# Altium project Keyboard_Project.PrjPcb
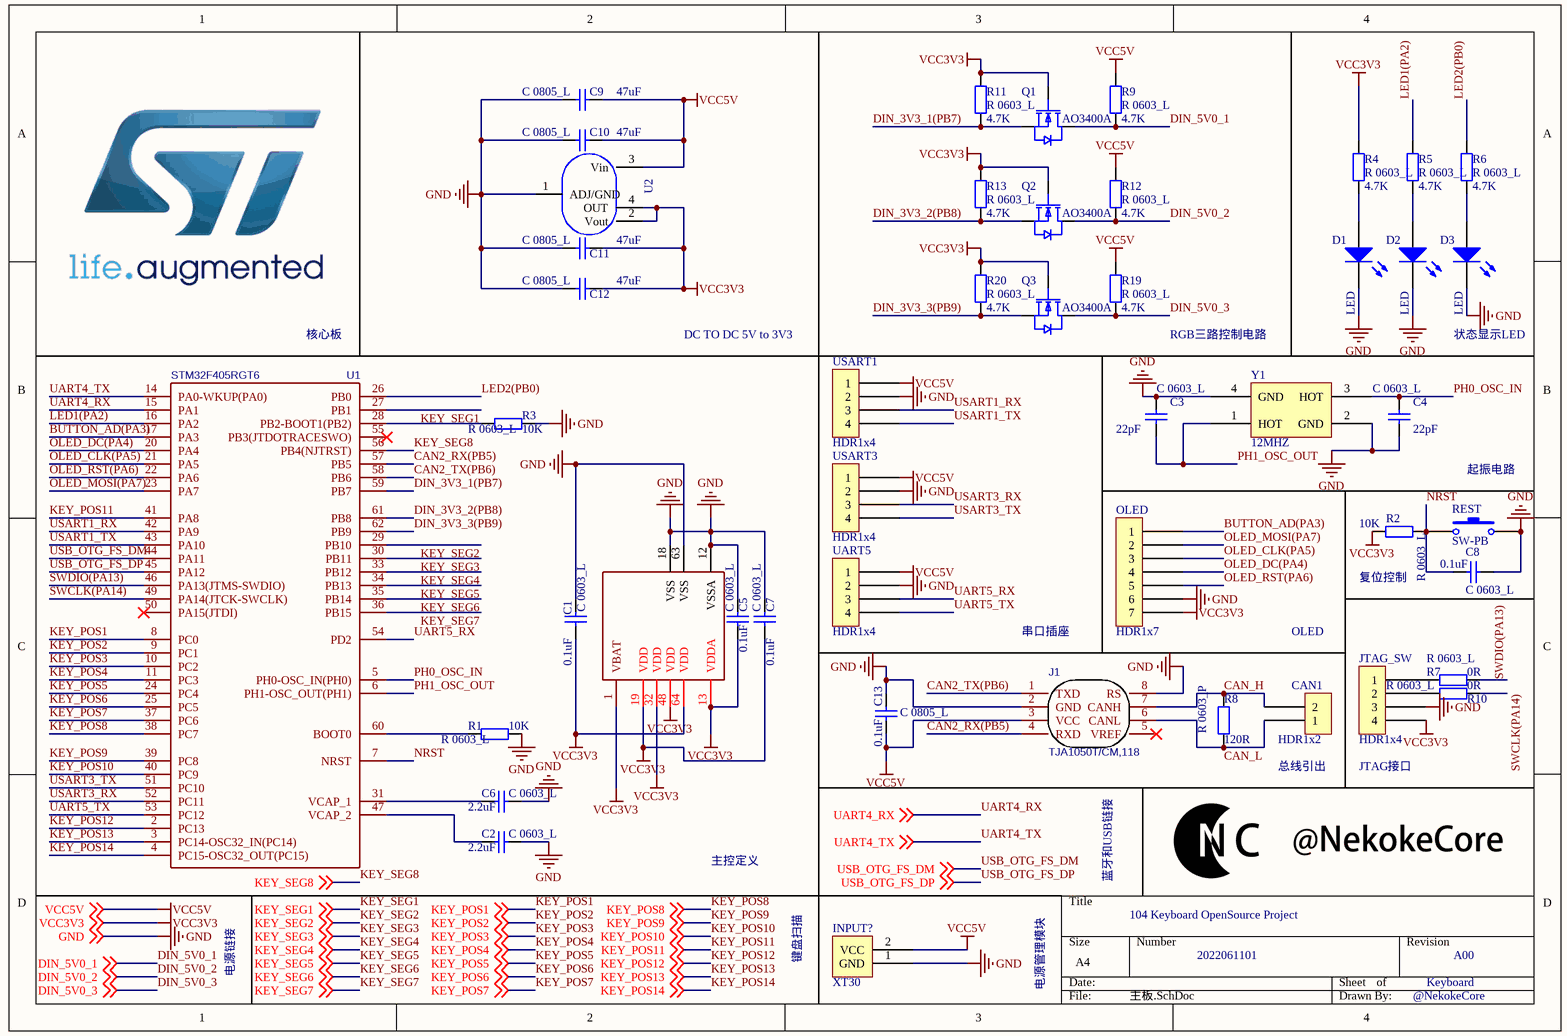
[diagram p0: 主板.SchDoc]
1 sheet, 46 parts. Net scope: global (net labels, ports and power ports of the same name join across sheets).
Board file: 键盘.PcbDoc

## Sheet 主板.SchDoc
size A4; SheetNumber: 1; SheetTotal: 3

### Parts
C1  C 0603_L  value 0.1uF  [C 0603_L]
C2  C 0603_L  value 2.2uF  [C 0603_L]
C3  C 0603_L  value 22pF  [C 0603_L]
C4  C 0603_L  value 22pF  [C 0603_L]
C5  C 0603_L  value 0.1uF  [C 0603_L]
C6  C 0603_L  value 2.2uF  [C 0603_L]
C7  C 0603_L  value 0.1uF  [C 0603_L]
C8  C 0603_L  value 0.1uF  [C 0603_L]
C9  C 0805_L  value 47uF  [C 0805_L]
C10  C 0805_L  value 47uF  [C 0805_L]
C11  C 0805_L  value 47uF  [C 0805_L]
C12  C 0805_L  value 47uF  [C 0805_L]
C13  C 0805_L  value 0.1uF  [C 0805_L]
CAN1  HDR1x2  [GH1.25-立贴-2P]
D1  LED  [LED 0805R]
D2  LED  [LED 0805R]
D3  LED  [LED 0805R]
INPUT?  XT30  [XT30PW-M]
J1  TJA1050T/CM,118  [SOIC-8_150MIL]
JTAG_SW  HDR1x4  [GH1.25-立贴-4P]
OLED  HDR1x7  [GH1.25-立贴-7P]
Q1  AO3400A  [AO3400A]
Q2  AO3400A  [AO3400A]
Q3  AO3400A  [AO3400A]
R1  R 0603_L  value 10K  [R 0603_L]
R2  R 0603_L  value 10K  [R 0603_L]
R3  R 0603_L  value 10K  [R 0603_L]
R4  R 0603_L  value 4.7K  [R 0603_L]
R5  R 0603_L  value 4.7K  [R 0603_L]
R6  R 0603_L  value 4.7K  [R 0603_L]
R7  R 0603_L  value 0R  [R 0603_L]
R8  R 0603_P  value 120R  [0603P]
R9  R 0603_L  value 4.7K  [R 0603_L]
R10  R 0603_L  value 0R  [R 0603_L]
R11  R 0603_L  value 4.7K  [R 0603_L]
R12  R 0603_L  value 4.7K  [R 0603_L]
R13  R 0603_L  value 4.7K  [R 0603_L]
R19  R 0603_L  value 4.7K  [R 0603_L]
R20  R 0603_L  value 4.7K  [R 0603_L]
REST  SW-PB  [SMD-3.2*4.2]
U1  STM32F405RGT6  [STM32F405RGT6]
U2  SPX1117M3-L-3-3  [SPX1117M3-L-3-3/TR]  (value not drawn)
UART5  HDR1x4  [GH1.25-立贴-4P]
USART1  HDR1x4  [GH1.25-立贴-4P]
USART3  HDR1x4  [GH1.25-立贴-4P]
Y1  12MHZ  [SMD-3225_4P]

### Nets
GND: C1.2 C2.2 C3.2 C4.1 C5.2 C6.2 C7.2 C8.2 C9.1 C10.1 C11.1 C12.1 C13.2 D1.2(K) D2.2(K) D3.2(K) INPUT?.1(GND) J1.2(GND) J1.8(RS) JTAG_SW.3 OLED.6 R1.2 R3.2 REST.2 U1.12(VSSA) U1.18(VSS) U1.63(VSS) U2.1(ADJ/GND) UART5.2 USART1.2 USART3.2 Y1.2(GND) Y1.4(GND) ; off-sheet GND
VCC3V3: C1.1 C5.1 C7.1 C11.2 C12.2 JTAG_SW.4 OLED.7 Q1.1(G) Q2.1(G) Q3.1(G) R2.1 R4.2 R11.2 R13.2 R20.2 U1.1(VBAT) U1.13(VDDA) U1.19(VDD) U1.32(VDD) U1.48(VDD) U1.64(VDD) U2.2(Vout) U2.4(OUT) ; off-sheet VCC3V3
VCC5V: C9.2 C10.2 C13.1 INPUT?.2(VCC) J1.3(VCC) R9.2 R12.2 R19.2 U2.3(Vin) UART5.1 USART1.1 USART3.1 ; off-sheet VCC5V
BUTTON_AD(PA3): OLED.1 U1.17(PA3)
CAN2_RX(PB5): J1.4(RXD) U1.57(PB5)
CAN2_TX(PB6): J1.1(TXD) U1.58(PB6)
CAN_H: CAN1.2 J1.7(CANH) R8.2
CAN_L: CAN1.1 J1.6(CANL) R8.1
DIN_3V3_1(PB7): Q1.2(S) R11.1 U1.59(PB7)
DIN_3V3_2(PB8): Q2.2(S) R13.1 U1.61(PB8)
DIN_3V3_3(PB9): Q3.2(S) R20.1 U1.62(PB9)
DIN_5V0_1: Q1.3(D) R9.1 ; off-sheet DIN_5V0_1
DIN_5V0_2: Q2.3(D) R12.1 ; off-sheet DIN_5V0_2
DIN_5V0_3: Q3.3(D) R19.1 ; off-sheet DIN_5V0_3
KEY_POS1: U1.8(PC0) ; off-sheet KEY_POS1
KEY_POS2: U1.9(PC1) ; off-sheet KEY_POS2
KEY_POS3: U1.10(PC2) ; off-sheet KEY_POS3
KEY_POS4: U1.11(PC3) ; off-sheet KEY_POS4
KEY_POS5: U1.24(PC4) ; off-sheet KEY_POS5
KEY_POS6: U1.25(PC5) ; off-sheet KEY_POS6
KEY_POS7: U1.37(PC6) ; off-sheet KEY_POS7
KEY_POS8: U1.38(PC7) ; off-sheet KEY_POS8
KEY_POS9: U1.39(PC8) ; off-sheet KEY_POS9
KEY_POS10: U1.40(PC9) ; off-sheet KEY_POS10
KEY_POS11: U1.41(PA8) ; off-sheet KEY_POS11
KEY_POS12: U1.2(PC13) ; off-sheet KEY_POS12
KEY_POS13: U1.3(PC14-OSC32_IN(PC14)) ; off-sheet KEY_POS13
KEY_POS14: U1.4(PC15-OSC32_OUT(PC15)) ; off-sheet KEY_POS14
KEY_SEG1: U1.27(PB1) ; off-sheet KEY_SEG1
KEY_SEG2: U1.29(PB10) ; off-sheet KEY_SEG2
KEY_SEG3: U1.30(PB11) ; off-sheet KEY_SEG3
KEY_SEG4: U1.33(PB12) ; off-sheet KEY_SEG4
KEY_SEG5: U1.34(PB13) ; off-sheet KEY_SEG5
KEY_SEG6: U1.35(PB14) ; off-sheet KEY_SEG6
KEY_SEG7: U1.36(PB15) ; off-sheet KEY_SEG7
KEY_SEG8: U1.56(PB4(NJTRST)) ; off-sheet KEY_SEG8
LED1(PA2): R5.2 U1.16(PA2)
LED2(PB0): R6.2 U1.26(PB0)
NRST: C8.1 R2.2 REST.1 U1.7(NRST)
OLED_CLK(PA5): OLED.3 U1.21(PA5)
OLED_DC(PA4): OLED.4 U1.20(PA4)
OLED_MOSI(PA7): OLED.2 U1.23(PA7)
OLED_RST(PA6): OLED.5 U1.22(PA6)
PH0_OSC_IN: C4.2 U1.5(PH0-OSC_IN(PH0)) Y1.3(HOT)
PH1_OSC_OUT: C3.1 U1.6(PH1-OSC_OUT(PH1)) Y1.1(HOT)
SWCLK(PA14): R10.2 U1.49(PA14(JTCK-SWCLK))
SWDIO(PA13): R7.2 U1.46(PA13(JTMS-SWDIO))
UART4_RX: U1.15(PA1) ; off-sheet UART4_RX
UART4_TX: U1.14(PA0-WKUP(PA0)) ; off-sheet UART4_TX
UART5_RX: U1.54(PD2) UART5.3
UART5_TX: U1.53(PC12) UART5.4
USART1_RX: U1.42(PA9) USART1.3
USART1_TX: U1.43(PA10) USART1.4
USART3_RX: U1.52(PC11) USART3.3
USART3_TX: U1.51(PC10) USART3.4
USB_OTG_FS_DM: U1.44(PA11) ; off-sheet USB_OTG_FS_DM
USB_OTG_FS_DP: U1.45(PA12) ; off-sheet USB_OTG_FS_DP
NetC2_1: C2.1 U1.47(VCAP_2)
NetC6_1: C6.1 U1.31(VCAP_1)
NetD1_1: D1.1(A) R4.1
NetD2_1: D2.1(A) R5.1
NetD3_1: D3.1(A) R6.1
NetJTAG_SW_1: JTAG_SW.1 R7.1
NetJTAG_SW_2: JTAG_SW.2 R10.1
NetR1_1: R1.1 U1.60(BOOT0)
NetR3_1: R3.1 U1.28(PB2-BOOT1(PB2))

Not connected (* = marked no-connect by the designer): J1 5(VREF)*; U1 50(PA15(JTDI))* 55(PB3(JTDOTRACESWO))*

### Notes on the sheet
- 核心板
- DC TO DC 5V to 3V3
- RGB三路控制电路
- 状态显示LED
- 起振电路
- (near R2) 复位控制
- 串口插座
- OLED
- 总线引出
- (near JTAG_SW) JTAG接口
- (near U1) 主控定义
- 蓝牙和USB链接
- 104 Keyboard OpenSource Project
- 电源链接
- 键盘扫描
- 电源管理模块
- 2022061101
- Keyboard
- A00
- @NekokeCore

### Library data of the parts
C1-C8 = C 0603_L: Capacitor; Published: 8-Jun-2000; LatestRevisionDate: 17-Jul-2002; LatestRevisionNote: Re-released for DXP Platform.; PackageReference: RAD-0.3; Publisher: Altium Limited; PackageDescription: Radial Cap, Thru-Hole; 2 Leads; 0.3 in Pin Spacing
C9-C13 = C 0805_L: Capacitor; Published: 8-Jun-2000; LatestRevisionDate: 17-Jul-2002; LatestRevisionNote: Re-released for DXP Platform.; PackageReference: RAD-0.3; Publisher: Altium Limited; PackageDescription: Radial Cap, Thru-Hole; 2 Leads; 0.3 in Pin Spacing
D1-D3 = LED 0805R 红: Typical INFRARED GaAs LED; Published: 8-Jun-2000; LatestRevisionDate: 08-Jul-2005; LatestRevisionNote: Mech Layer 1 removed.; PackageReference: LED-0; Publisher: Altium Limited; PackageDescription: LED; 2 Leads
J1 = TJA1050T/CM,118: BOM_Manufacturer: NXP; BOM_Supplier: LCSC; BOM_Manufacturer Part: TJA1050T/CM,118; BOM_Supplier Part: C6952; BOM_JLCPCB Part Class: Basic Part; spicePre: U; spiceSymbolName: TJA1050T/CM,118
JTAG_SW UART5 USART1 USART3 = HDR1x4_卧
Q1-Q3 = 2N7002,215: Manufacturer: Nexperia(安世); Add into BOM: yes; Type: N沟道; Drain Source Voltage (Vdss): 60V; Continuous Drain Current (Id): 300mA; Power Dissipation (Pd): 830mW; Drain Source On Resistance (RDS(on)@Vgs,Id): 5Ω@10V,500mA; Gate Threshold Voltage (Vgs(th)@Id): 2.5V@250A; Symbol: 2N7002,215; Device: 2N7002,215; LCSC Part Name: N沟道 60V 300mA; Supplier Part: C65189; Manufacturer Part: 2N7002,215; Supplier Footprint: SOT-23(SOT-23-3); JLCPCB Part Class: Extended Part; Datasheet: https://atta.szlcsc.com/upload/public/pdf/source/20170103/1483439882638.pdf; Supplier: LCSC; Convert to PCB: yes
R1-R7 R9-R13 R19 R20 = R 0603_L: Resistor; Published: 8-Jun-2000; LatestRevisionDate: 17-Jul-2002; LatestRevisionNote: Re-released for DXP Platform.; PackageReference: AXIAL-0.4; Publisher: Altium Limited; PackageDescription: Axial Device, Thru-Hole; 2 Leads; 0.4 in Pin Spacing
R8 = R 0603_P: Resistor; Published: 8-Jun-2000; LatestRevisionDate: 17-Jul-2002; LatestRevisionNote: Re-released for DXP Platform.; PackageReference: AXIAL-0.4; Publisher: Altium Limited; PackageDescription: Axial Device, Thru-Hole; 2 Leads; 0.4 in Pin Spacing
REST = SW-PB: Switch; Published: 24-Mar-1999; LatestRevisionDate: 17-Jul-2002; LatestRevisionNote: Re-released for DXP Platform.; PackageReference: SPST-2; Publisher: Altium Limited; PackageDescription: Switch; 2 Leads
U1 = STM32F405RGT6: BOM_Manufacturer: ST; subpart_no: 1; tags: STM32; BOM_Supplier Part: C15742; BOM_Supplier: LCSC; BOM_Manufacturer Part: STM32F405RGT6; image: http://image.lceda.cn/szlcsc/C15742.jpg; BOM_JLCPCB Part Class: Extended Part; spicePre: U; spiceSymbolName: STM32F405RGT6
U2 = SPX1117M3-L-3-3: Manufacturer: UTC(友顺); Symbol: LM317G-AA3-R; Add into BOM: yes; Output Type: 可调; Output Polarity: 正; Number of Outputs: 1; Maximum Input Voltage: 40V; Output Voltage: 1.3V~37V; Dropout Voltage: 5V@(10mA); Output Current: 1A; Device: LM317G-AA3-R; LCSC Part Name: Vin=40V Vout=1.3V~37V 1A; Supplier Part: C19651; Manufacturer Part: LM317G-AA3-R; Supplier Footprint: SOT-223; JLCPCB Part Class: Extended Part; Datasheet: https://atta.szlcsc.com/upload/public/pdf/source/20160416/1460799387250.pdf; Supplier: LCSC; Convert to PCB: yes
Y1 = 3325 12Mhz: 3325 12MHZ 无源晶振